# Altium schematic sheet Node.SchDoc
size A4; SheetNumber: 1; SheetTotal: 6
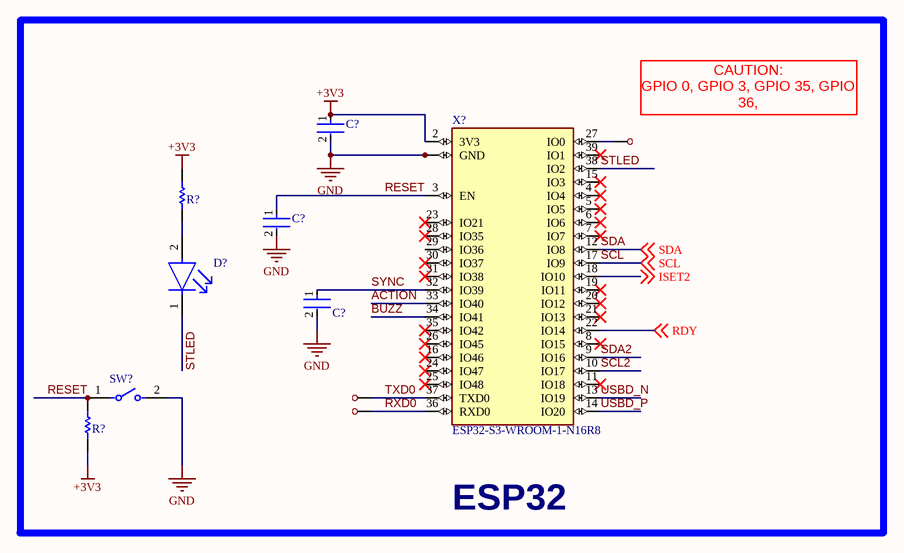
[diagram p0: Node.SchDoc]

## Parts
(Parts that share a designator on the sheet are numbered #1, #2 ... from top to bottom, then left to right.)
C?#1  CC0603KRX7R7BB105  [FP-CC0603-DA-MFG]  (value not drawn)
C?#2  CC0603KRX7R7BB105  [FP-CC0603-DA-MFG]  (value not drawn)
C?#3  C0603C104J4RACTU  [FP-C0603C-CF-MFG]  (value not drawn)
D?  VLMB1300-GS08  [FP-6_541-5094_01-4-MFG]  (value not drawn)
R?#1  RC0603FR-072KL  [RESC1608X55X25LL10T15]  (value not drawn)
R?#2  ERJ3EKF1002V  [RESC1609X55X30LL15T15]  (value not drawn)
SW?  B3U-1000P-B  [FP-B3U-1000P-B-MFG]  (value not drawn)
TP?#1  Test Point  [Test Point]  (value not drawn)
TP?#2  Test Point  [Test Point]  (value not drawn)
TP?#3  Test Point  [Test Point]  (value not drawn)
X?  ESP32-S3-WROOM-1-N16R8  [ESP32S3WROOM1N8R2]

## Blocks framed on the sheet
ESP32: C?#1-C?#3 D? R?#1 R?#2 SW? TP?#1-TP?#3 X?

## Nets
+3V3: C?#1.1 R?#1.2 R?#2.1 X?.2(3V3)
GND: C?#1.2 C?#2.2 C?#3.2 SW?.2 X?.1(GND) X?.40(GND) X?.41(GND) X?.42(GND) X?.43(GND) X?.44(GND) X?.45(GND) X?.46(GND) X?.47(GND) X?.48(GND) X?.49(GND)
ACTION: X?.33(IO40)
BUZZ: X?.34(IO41)
ISET2: X?.18(IO10) ; off-sheet ISET2
RDY: X?.22(IO14) ; off-sheet RDY
RESET: C?#2.1 R?#2.2 SW?.1 X?.3(EN)
RXD0: TP?#3.1(TP) X?.36(RXD0)
SCL: X?.17(IO9) ; off-sheet SCL
SCL2: X?.10(IO17)
SDA: X?.12(IO8) ; off-sheet SDA
SDA2: X?.9(IO16)
STLED: D?.1(C) X?.38(IO2)
SYNC: C?#3.1 X?.32(IO39)
TXD0: TP?#2.1(TP) X?.37(TXD0)
USBD_N: X?.13(IO19)
USBD_P: X?.14(IO20)
NetD?_2: D?.2(A) R?#1.1
NetTP?#1_1: TP?#1.1(TP) X?.27(IO0)

Not connected (* = marked no-connect by the designer): X? 4(IO4)* 5(IO5)* 6(IO6)* 7(IO7)* 8(IO15)* 11(IO18)* 15(IO3)* 16(IO46)* 19(IO11)* 20(IO12)* 21(IO13)* 23(IO21)* 24(IO47)* 25(IO48)* 26(IO45)* 28(IO35)* 29(IO36) 30(IO37)* 31(IO38)* 35(IO42)* 39(IO1)*

## Notes on the sheet
- (near TP?#1) CAUTION:
  GPIO 0, GPIO 3, GPIO 35, GPIO 36,
  GPIO 37, GPIO 45, GPIO 46

## Library data of the parts
C?#1 C?#2 = CMP-03422-000924-1: CAP CER 1UF 16V X7R 0603; Manufacturer: YAGEO; Tolerance: 0.1; Temperature Coefficient: 15%; Material: Ceramic; Package: CC0603-DA; RoHS: TRUE; Device Class L2: Capacitors; Temperature Characteristic: X7R; Temperature: -55°C to +125°C; Temperature Range Low: -55°C; Automotive: No; ComponentLink2Description: Datasheet; Value: 1 uF; Lead Free: Yes; Capacitance: 1 uF; ComponentLink2URL: http://www.yageo.com/documents/recent/UPY-GPHC_X7R_6.3V-to-50V_18.pdf; Device Class L1: Passive Components; Voltage: 16 V; Octopart: https://octopart.com/cc0603krx7r7bb105-yageo-42271928; Category: Cap; Digikey Description: CAP CER 1UF 16V X7R 0603; Footprint Url: http://www.yageo.com/exep/pages/download/literatures/UPY-C_GEN_24.pdf; Height: 0.9mm; Manufacturer Part Number: CC0603KRX7R7BB105; Voltage Rating: 16 V; Temperature Range High: +125°C; Mouser Description: Multilayer Ceramic Capacitor, CC Series, 1 - F, - 10%, X7R, 16 V, 0603 [1608 Metric]; Device Class L3: Ceramic Capacitors
C?#3 = CMP-2006-03054-2: CAP CER 0.1UF 16V X7R 0603; Manufacturer: KEMET; Material: Ceramic; Capacitance: 0.10 μF; Tolerance: 0.05; Automotive Grade: Grade 1; Value: 0.10 μF; Temperature Coefficient: 30ppm/°C; Digikey Description: CAP CER 0.1UF 16V X7R 0603; Automotive: Yes; Octopart: https://octopart.com/c0603c104j4ractu-kemet-102515; Device Class L2: Capacitors; Temperature Characteristic: X7R; Category: Cap; Mouser Description: Cap Ceramic 0.1uF 16V X7R 5% SMD 0603 125°C Paper T/R; Voltage Rating: 16 V; Temperature Range Low: -55°C; Manufacturer Part Number: C0603C104J4RACTU; Device Class L1: Passive Components; ComponentLink2URL: https://api.kemet.com/component-edge/download/datasheet/C0603C100J5GACAUTO.pdf; Lead Free: Yes; Temperature Range High: +125°C; Height: 0.87mm; Device Class L3: Ceramic Capacitors; ComponentLink2Description: Datasheet; Package: C0603C-CF; RoHS: TRUE; Temperature: -55°C to +125°C
D? = CMP-02520-000013-1: LED BLUE 0603 SMD; Manufacturer: Vishay Semiconductor Opto Division; Forward Current: 20mA; Wavelength: 475nm; Viewing Angle: 130°; Forward Voltage: 3.8V; Power Dissipation: 76mW; Luminous Intensity: 28-180mcd; Led Orientation: Top View; Peak Emmision Wavelength: 468nm; RoHS: TRUE; ComponentLink2URL: http://www.vishay.com/docs/82437/vlmo1300.pdf; Ambient Temperature Range Low: -20°C; ComponentLink2Description: Datasheet; Mouser Description: LED; SMD; 0603; blue; 28-180mcd; 1.6x0.8x0.8mm; 130°; 2.8÷3.8V; 20mA; Manufacturer Part Number: VLMB1300-GS08; Package: 6.541-5094.01-4; Device Class L3: unset; Automotive: No; Temperature: -20°C to +80°C; Colour: Blue; Digikey Description: LED BLUE 0603 SMD; Device Class L2: LEDs; Temperature Range Low: -20°C; Lead Free: Yes; Category: Diode; Device Class L1: Optoelectronics; Height: 1mm; Octopart: https://octopart.com/vlmb1300-gs08-vishay-22022408; Temperature Range High: +80°C; Ambient Temperature Range High: +80°C
R?#1 = CMP-2000-06937-1: Chip Resistor, 2 KOhm, +/- 1%, 50 V, -55 to 155 degC, 0603 (1608 Metric), RoHS, Tape and Reel; Manufacturer: Yageo; PCN Other: RC/AC0603/0805/120622/Jan/2013; Resistance (Ohms): 2k; Catalog Drawings: ThickFilmResistorTopThickFilmResistorSide; Kits: PHH4-KIT-ND-RESKIT1K-9.76K1/10W5700PCS; EDA / CAD Models: DownloadfromAcceleratedDesigns; HTML Datasheet: RCSeries,LSuffixDatasheet.html; Power (Watts): 0.1W,1/10W; Other Names: 311-2.00KHRCT; Temperature Coefficient: ±100ppm/°C; Online Catalog: RC0603Series; Features: MoistureResistant; Height: 0.022"(0.55mm); Size / Dimension: 0.063"Lx0.031"W(1.60mmx0.80mm); Product Training Modules: ChipResistor; Mounting Technology: SurfaceMount; Package / Case: 0603(1608Metric); Supplier Device Package: 0603; Category: Resistors; Tolerance: ±1%; Packaging: CutTape(CT); Operating Temperature: -55°C~155°C; Standard Package: 1; Series: RC; Datasheet URL: http://www.yageo.com/documents/recent/PYu-RC_Group_51_RoHS_L_7.pdf; Package Description: 2-Pin Surface Mount Device, Body 1.6 x 0.8 mm; Number of Terminations: 2; Datasheet Version: Rev. 7, 05/2017; Package Reference: 0603; Composition: ThickFilm; Manufacturer URL: http://www.yageo.com/; Family: ChipResistor-SurfaceMount
R?#2 = CMP-1012-00623-3: Chip Resistor, 10 KOhm, +/- 1%, 0.1 W, -55 to 155 degC, 0603 (1608 Metric), RoHS, Tape and Reel; Manufacturer: Panasonic; Voltage Rating: 75V; Case\/Package: 0603; Power Rating: 100mW; Resistance: 10KOhm; Temperature Coefficient: 100ppm\/degreesC; Number of Pins: 2; Package Reference: 603; Depth: 0.8mm; Mount: SurfaceMount; Package Description: 2-Pin Surface Mount Device, Body 1.6 x 0.85 mm; Datasheet Version: 02/2017; Length: 1.6mm; Lead Free: LeadFree; Height: 0.45mm; Number of Terminations: 2; Max Power Dissipation: 100mW; Min Operating Temperature: -55degC; Datasheet URL: https://industrial.panasonic.com/cdbs/www-data/pdf/RDA0000/AOA0000C304.pdf; Termination: SMD/SMT; Case Code (Metric): 1608; Case Code (Imperial): 0603; Tolerance: 1%; Max Operating Temperature: 155degC; RoHSCompliant: true; Voltage Rating (DC): 75V; Radiation Hardening: No; Packaging: TapeandReel; Composition: ThickFilm; Mounting Technology: SurfaceMount; Manufacturer URL: http://www.panasonic.com/; Width: 0.031inch; REACH SVHC: NoSVHC; Contact Plating: Tin; Military Standard: Not; Package Quantity: 1
SW? = CMP-08834-000005-1: SWITCH TACTILE SPST-NO 0.05A 12V; Manufacturer: Omron; Operating Force: 1.5N; Contact Current Rating: 50mA; Contact Resistance: 100mΩ; Electromechanical Life: 200000Cycles; Height: 1.75mm; Device Class L2: Switches; Temperature Range High: +70°C; Digikey Description: SWITCH TACTILE SPST-NO 0.05A 12V; Throw Configuration: SPST-NO; Ambient Temperature Range High: +70°C; Temperature: -25°C to +70°C; Lead Free: Yes; ComponentLink2URL: https://omronfs.omron.com/en_US/ecb/products/pdf/en-b3u.pdf; Device Class L3: Tactile Switches; Manufacturer Part Number: B3U-1000P-B; Ambient Temperature Range Low: -25°C; Mount: Surface Mount; Automotive: No; Mouser Description: Tactile Switches Top Actuated with boss w/o ground; Octopart: https://octopart.com/b3u-1000p-b-omron-1057356; RoHS: TRUE; Package: 0; Device Class L1: Electromechanical; Voltage Rating Dc: 12V; Category: Switch; Temperature Range Low: -25°C; ComponentLink2Description: Datasheet
X? = ESP32-S3-WROOM-1-N16R8: Bluetooth, WiFi 802.11b/g/n, Bluetooth v5.0 Transceiver Module 2.4GHz PCB Trace Surface Mount; MF: Espressif Systems; SnapEDA_Link: https://www.snapeda.com/parts/ESP32-S3-WROOM-1-N16R8/Espressif+Systems/view-part/?ref=snap; Package: NON STANDARD Espressif Systems; Value: *; MP: ESP32-S3-WROOM-1-N16R8; Check_prices: https://www.snapeda.com/parts/ESP32-S3-WROOM-1-N16R8/Espressif+Systems/view-part/?ref=eda